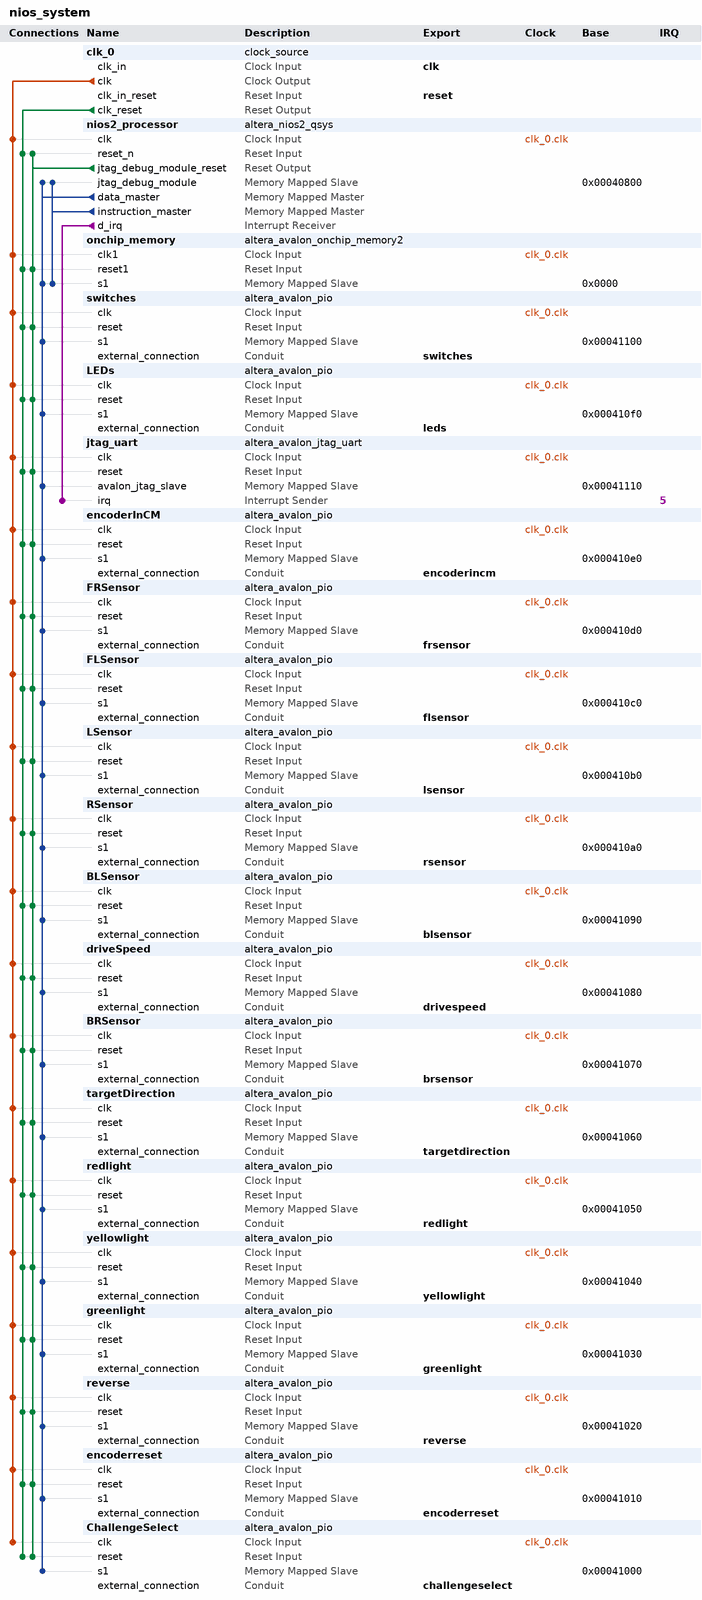
[diagram p0: system contents]
# Platform Designer (Qsys) system nios_system, Cyclone V 5CSEMA5F31C6
# Parameters at their usual value, and those the tool derives, are not listed.
package require -exact qsys 17.0
create_system nios_system
set_project_property DEVICE_FAMILY {Cyclone V}
set_project_property DEVICE 5CSEMA5F31C6

add_instance clk_0 clock_source 17.0
set_instance_parameter_value clk_0 clockFrequency 50000000

add_instance nios2_processor altera_nios2_qsys 16.1
set_instance_parameter_value nios2_processor breakSlave nios2_processor.jtag_debug_module
set_instance_parameter_value nios2_processor exceptionSlave onchip_memory.s1
set_instance_parameter_value nios2_processor icache_size 4096
set_instance_parameter_value nios2_processor impl Tiny
set_instance_parameter_value nios2_processor mmu_TLBMissExcSlave None
set_instance_parameter_value nios2_processor resetSlave onchip_memory.s1
set_instance_parameter_value nios2_processor resetrequest_enabled true

add_instance onchip_memory altera_avalon_onchip_memory2 17.0
set_instance_parameter_value onchip_memory dataWidth 32
set_instance_parameter_value onchip_memory dualPort false
set_instance_parameter_value onchip_memory initMemContent true
set_instance_parameter_value onchip_memory initializationFileName C:/intelFPGA_lite/17.0/TestQsys/app_software/nios_system_onchip_memory.hex
set_instance_parameter_value onchip_memory memorySize 262144
set_instance_parameter_value onchip_memory useNonDefaultInitFile true

add_instance switches altera_avalon_pio 17.0
set_instance_parameter_value switches direction Input
set_instance_parameter_value switches width 8

add_instance LEDs altera_avalon_pio 17.0
set_instance_parameter_value LEDs direction Output
set_instance_parameter_value LEDs width 8

add_instance jtag_uart altera_avalon_jtag_uart 17.0
set_instance_parameter_value jtag_uart simInteractiveOptions NO_INTERACTIVE_WINDOWS

add_instance encoderInCM altera_avalon_pio 17.0
set_instance_parameter_value encoderInCM direction Input
set_instance_parameter_value encoderInCM width 32

add_instance FRSensor altera_avalon_pio 17.0
set_instance_parameter_value FRSensor direction Input
set_instance_parameter_value FRSensor width 9

add_instance FLSensor altera_avalon_pio 17.0
set_instance_parameter_value FLSensor direction Input
set_instance_parameter_value FLSensor width 9

add_instance LSensor altera_avalon_pio 17.0
set_instance_parameter_value LSensor direction Input
set_instance_parameter_value LSensor width 9

add_instance RSensor altera_avalon_pio 17.0
set_instance_parameter_value RSensor direction Input
set_instance_parameter_value RSensor width 9

add_instance BLSensor altera_avalon_pio 17.0
set_instance_parameter_value BLSensor direction Input
set_instance_parameter_value BLSensor width 9

add_instance driveSpeed altera_avalon_pio 17.0
set_instance_parameter_value driveSpeed direction Output
set_instance_parameter_value driveSpeed width 7

add_instance BRSensor altera_avalon_pio 17.0
set_instance_parameter_value BRSensor direction Input
set_instance_parameter_value BRSensor width 9

add_instance targetDirection altera_avalon_pio 17.0
set_instance_parameter_value targetDirection direction Output
set_instance_parameter_value targetDirection width 9

add_instance redlight altera_avalon_pio 17.0
set_instance_parameter_value redlight direction Input
set_instance_parameter_value redlight width 1

add_instance yellowlight altera_avalon_pio 17.0
set_instance_parameter_value yellowlight direction Input
set_instance_parameter_value yellowlight width 1

add_instance greenlight altera_avalon_pio 17.0
set_instance_parameter_value greenlight direction Input
set_instance_parameter_value greenlight width 1

add_instance reverse altera_avalon_pio 17.0
set_instance_parameter_value reverse direction Output
set_instance_parameter_value reverse width 1

add_instance encoderreset altera_avalon_pio 17.0
set_instance_parameter_value encoderreset direction Output
set_instance_parameter_value encoderreset width 1

add_instance ChallengeSelect altera_avalon_pio 17.0
set_instance_parameter_value ChallengeSelect direction Input
set_instance_parameter_value ChallengeSelect width 4

# connections
add_connection clk_0.clk BLSensor.clk clock
add_connection clk_0.clk BRSensor.clk clock
add_connection clk_0.clk ChallengeSelect.clk clock
add_connection clk_0.clk driveSpeed.clk clock
add_connection clk_0.clk encoderInCM.clk clock
add_connection clk_0.clk encoderreset.clk clock
add_connection clk_0.clk FLSensor.clk clock
add_connection clk_0.clk FRSensor.clk clock
add_connection clk_0.clk greenlight.clk clock
add_connection clk_0.clk jtag_uart.clk clock
add_connection clk_0.clk LEDs.clk clock
add_connection clk_0.clk LSensor.clk clock
add_connection clk_0.clk nios2_processor.clk clock
add_connection clk_0.clk onchip_memory.clk1 clock
add_connection clk_0.clk redlight.clk clock
add_connection clk_0.clk reverse.clk clock
add_connection clk_0.clk RSensor.clk clock
add_connection clk_0.clk switches.clk clock
add_connection clk_0.clk targetDirection.clk clock
add_connection clk_0.clk yellowlight.clk clock
add_connection clk_0.clk_reset BLSensor.reset reset
add_connection clk_0.clk_reset BRSensor.reset reset
add_connection clk_0.clk_reset ChallengeSelect.reset reset
add_connection clk_0.clk_reset driveSpeed.reset reset
add_connection clk_0.clk_reset encoderInCM.reset reset
add_connection clk_0.clk_reset encoderreset.reset reset
add_connection clk_0.clk_reset FLSensor.reset reset
add_connection clk_0.clk_reset FRSensor.reset reset
add_connection clk_0.clk_reset greenlight.reset reset
add_connection clk_0.clk_reset jtag_uart.reset reset
add_connection clk_0.clk_reset LEDs.reset reset
add_connection clk_0.clk_reset LSensor.reset reset
add_connection clk_0.clk_reset nios2_processor.reset_n reset
add_connection clk_0.clk_reset onchip_memory.reset1 reset
add_connection clk_0.clk_reset redlight.reset reset
add_connection clk_0.clk_reset reverse.reset reset
add_connection clk_0.clk_reset RSensor.reset reset
add_connection clk_0.clk_reset switches.reset reset
add_connection clk_0.clk_reset targetDirection.reset reset
add_connection clk_0.clk_reset yellowlight.reset reset
add_connection nios2_processor.jtag_debug_module_reset BLSensor.reset reset
add_connection nios2_processor.jtag_debug_module_reset BRSensor.reset reset
add_connection nios2_processor.jtag_debug_module_reset ChallengeSelect.reset reset
add_connection nios2_processor.jtag_debug_module_reset driveSpeed.reset reset
add_connection nios2_processor.jtag_debug_module_reset encoderInCM.reset reset
add_connection nios2_processor.jtag_debug_module_reset encoderreset.reset reset
add_connection nios2_processor.jtag_debug_module_reset FLSensor.reset reset
add_connection nios2_processor.jtag_debug_module_reset FRSensor.reset reset
add_connection nios2_processor.jtag_debug_module_reset greenlight.reset reset
add_connection nios2_processor.jtag_debug_module_reset jtag_uart.reset reset
add_connection nios2_processor.jtag_debug_module_reset LEDs.reset reset
add_connection nios2_processor.jtag_debug_module_reset LSensor.reset reset
add_connection nios2_processor.jtag_debug_module_reset nios2_processor.reset_n reset
add_connection nios2_processor.jtag_debug_module_reset onchip_memory.reset1 reset
add_connection nios2_processor.jtag_debug_module_reset redlight.reset reset
add_connection nios2_processor.jtag_debug_module_reset reverse.reset reset
add_connection nios2_processor.jtag_debug_module_reset RSensor.reset reset
add_connection nios2_processor.jtag_debug_module_reset switches.reset reset
add_connection nios2_processor.jtag_debug_module_reset targetDirection.reset reset
add_connection nios2_processor.jtag_debug_module_reset yellowlight.reset reset
add_connection nios2_processor.data_master BLSensor.s1 avalon
set_connection_parameter_value nios2_processor.data_master/BLSensor.s1 baseAddress 0x00041090
add_connection nios2_processor.data_master BRSensor.s1 avalon
set_connection_parameter_value nios2_processor.data_master/BRSensor.s1 baseAddress 0x00041070
add_connection nios2_processor.data_master ChallengeSelect.s1 avalon
set_connection_parameter_value nios2_processor.data_master/ChallengeSelect.s1 baseAddress 0x00041000
add_connection nios2_processor.data_master driveSpeed.s1 avalon
set_connection_parameter_value nios2_processor.data_master/driveSpeed.s1 baseAddress 0x00041080
add_connection nios2_processor.data_master encoderInCM.s1 avalon
set_connection_parameter_value nios2_processor.data_master/encoderInCM.s1 baseAddress 0x000410e0
add_connection nios2_processor.data_master encoderreset.s1 avalon
set_connection_parameter_value nios2_processor.data_master/encoderreset.s1 baseAddress 0x00041010
add_connection nios2_processor.data_master FLSensor.s1 avalon
set_connection_parameter_value nios2_processor.data_master/FLSensor.s1 baseAddress 0x000410c0
add_connection nios2_processor.data_master FRSensor.s1 avalon
set_connection_parameter_value nios2_processor.data_master/FRSensor.s1 baseAddress 0x000410d0
add_connection nios2_processor.data_master greenlight.s1 avalon
set_connection_parameter_value nios2_processor.data_master/greenlight.s1 baseAddress 0x00041030
add_connection nios2_processor.data_master jtag_uart.avalon_jtag_slave avalon
set_connection_parameter_value nios2_processor.data_master/jtag_uart.avalon_jtag_slave baseAddress 0x00041110
add_connection nios2_processor.data_master LEDs.s1 avalon
set_connection_parameter_value nios2_processor.data_master/LEDs.s1 baseAddress 0x000410f0
add_connection nios2_processor.data_master LSensor.s1 avalon
set_connection_parameter_value nios2_processor.data_master/LSensor.s1 baseAddress 0x000410b0
add_connection nios2_processor.data_master nios2_processor.jtag_debug_module avalon
set_connection_parameter_value nios2_processor.data_master/nios2_processor.jtag_debug_module baseAddress 0x00040800
add_connection nios2_processor.data_master onchip_memory.s1 avalon
set_connection_parameter_value nios2_processor.data_master/onchip_memory.s1 baseAddress 0x0000
add_connection nios2_processor.data_master redlight.s1 avalon
set_connection_parameter_value nios2_processor.data_master/redlight.s1 baseAddress 0x00041050
add_connection nios2_processor.data_master reverse.s1 avalon
set_connection_parameter_value nios2_processor.data_master/reverse.s1 baseAddress 0x00041020
add_connection nios2_processor.data_master RSensor.s1 avalon
set_connection_parameter_value nios2_processor.data_master/RSensor.s1 baseAddress 0x000410a0
add_connection nios2_processor.data_master switches.s1 avalon
set_connection_parameter_value nios2_processor.data_master/switches.s1 baseAddress 0x00041100
add_connection nios2_processor.data_master targetDirection.s1 avalon
set_connection_parameter_value nios2_processor.data_master/targetDirection.s1 baseAddress 0x00041060
add_connection nios2_processor.data_master yellowlight.s1 avalon
set_connection_parameter_value nios2_processor.data_master/yellowlight.s1 baseAddress 0x00041040
add_connection nios2_processor.instruction_master nios2_processor.jtag_debug_module avalon
set_connection_parameter_value nios2_processor.instruction_master/nios2_processor.jtag_debug_module baseAddress 0x00040800
add_connection nios2_processor.instruction_master onchip_memory.s1 avalon
set_connection_parameter_value nios2_processor.instruction_master/onchip_memory.s1 baseAddress 0x0000
add_connection nios2_processor.d_irq jtag_uart.irq interrupt
set_connection_parameter_value nios2_processor.d_irq/jtag_uart.irq irqNumber 5

# exported interfaces
add_interface blsensor conduit end
set_interface_property blsensor EXPORT_OF BLSensor.external_connection
add_interface brsensor conduit end
set_interface_property brsensor EXPORT_OF BRSensor.external_connection
add_interface challengeselect conduit end
set_interface_property challengeselect EXPORT_OF ChallengeSelect.external_connection
add_interface clk clock sink
set_interface_property clk EXPORT_OF clk_0.clk_in
add_interface drivespeed conduit end
set_interface_property drivespeed EXPORT_OF driveSpeed.external_connection
add_interface encoderincm conduit end
set_interface_property encoderincm EXPORT_OF encoderInCM.external_connection
add_interface encoderreset conduit end
set_interface_property encoderreset EXPORT_OF encoderreset.external_connection
add_interface flsensor conduit end
set_interface_property flsensor EXPORT_OF FLSensor.external_connection
add_interface frsensor conduit end
set_interface_property frsensor EXPORT_OF FRSensor.external_connection
add_interface greenlight conduit end
set_interface_property greenlight EXPORT_OF greenlight.external_connection
add_interface leds conduit end
set_interface_property leds EXPORT_OF LEDs.external_connection
add_interface lsensor conduit end
set_interface_property lsensor EXPORT_OF LSensor.external_connection
add_interface redlight conduit end
set_interface_property redlight EXPORT_OF redlight.external_connection
add_interface reset reset sink
set_interface_property reset EXPORT_OF clk_0.clk_in_reset
add_interface reverse conduit end
set_interface_property reverse EXPORT_OF reverse.external_connection
add_interface rsensor conduit end
set_interface_property rsensor EXPORT_OF RSensor.external_connection
add_interface switches conduit end
set_interface_property switches EXPORT_OF switches.external_connection
add_interface targetdirection conduit end
set_interface_property targetdirection EXPORT_OF targetDirection.external_connection
add_interface yellowlight conduit end
set_interface_property yellowlight EXPORT_OF yellowlight.external_connection

set_interconnect_requirement {$system} qsys_mm.clockCrossingAdapter HANDSHAKE
set_interconnect_requirement {$system} qsys_mm.enableEccProtection FALSE
set_interconnect_requirement {$system} qsys_mm.insertDefaultSlave FALSE
set_interconnect_requirement {$system} qsys_mm.maxAdditionalLatency 1

save_system nios_system.qsys
